# Altium schematic sheet Main.SchDoc
size A4; SheetNumber: 1; SheetTotal: 7
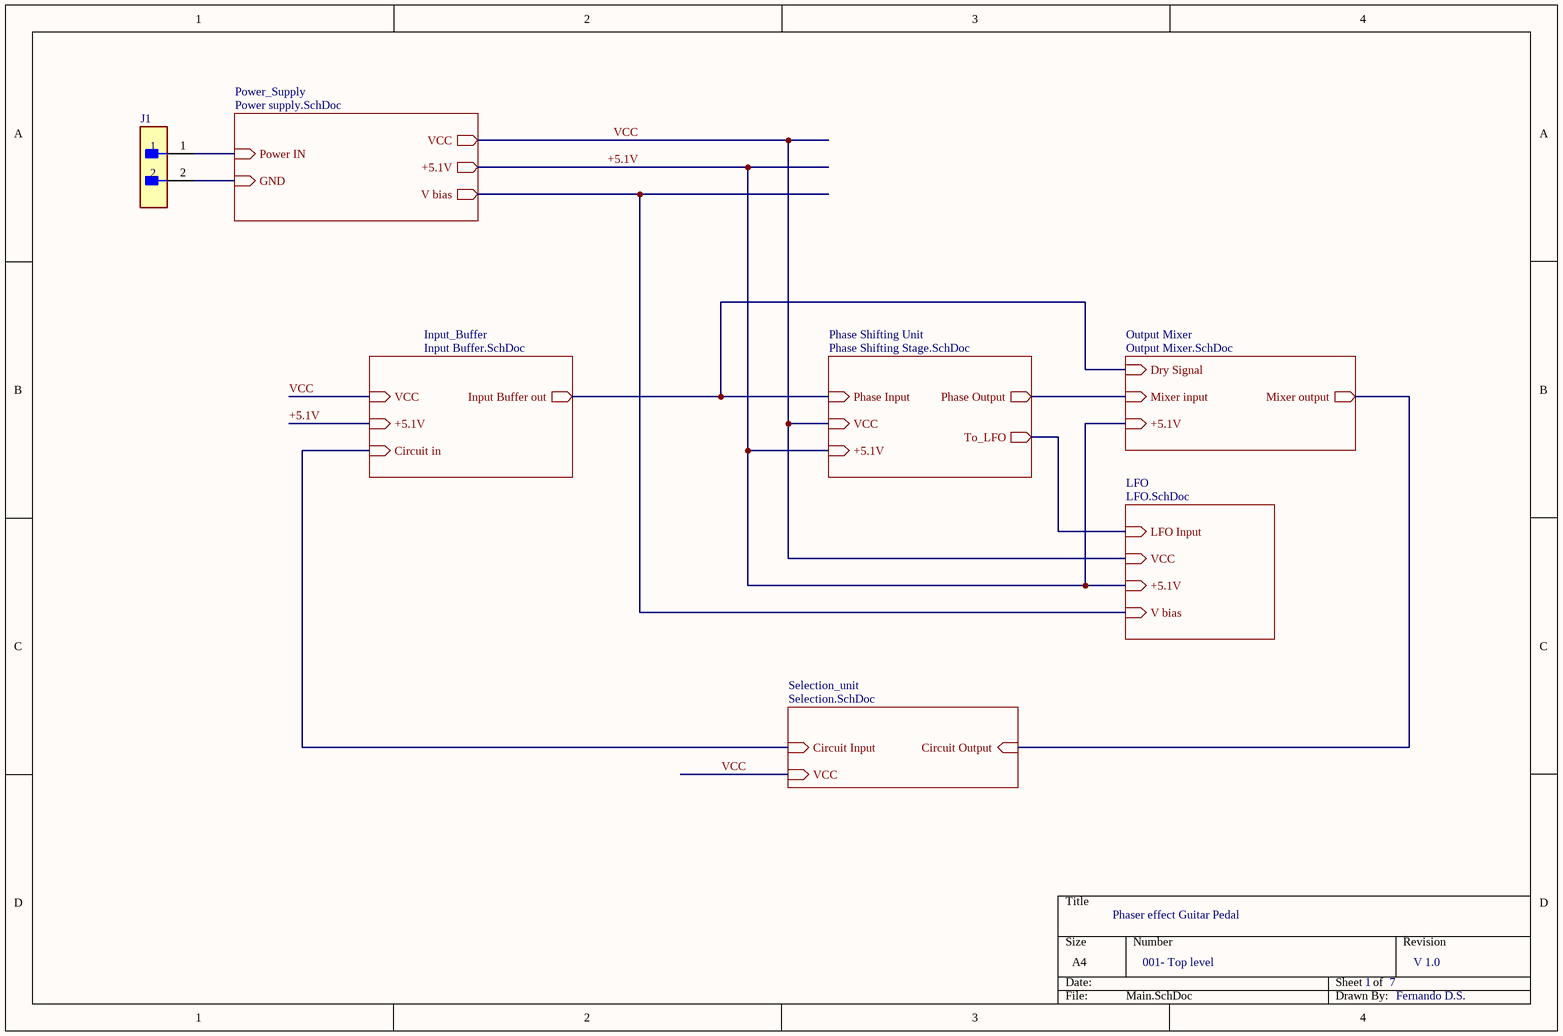
[diagram p0: Main.SchDoc]

## Parts
J1  B2B-EH-A(LF)(SN)  [FP-B2B-EH-A_LF_SN-MFG]  (value not drawn)

## Sub-sheets
Input_Buffer = Input Buffer.SchDoc: Circuit in (in), Input Buffer out (out), +5.1V (in), VCC (in)
LFO = LFO.SchDoc: LFO Input (in), VCC (in), +5.1V (in), V bias (in)
Output Mixer = Output Mixer.SchDoc: Dry Signal (in), Mixer input (in), Mixer output (out), +5.1V (in)
Phase Shifting Unit = Phase Shifting Stage.SchDoc: Phase Input (in), Phase Output (out), To_LFO (out), VCC (in), +5.1V (in)
Power_Supply = Power supply.SchDoc: Power IN (in), GND (in), VCC (out), +5.1V (out), V bias (out)
Selection_unit = Selection.SchDoc: Circuit Input (in), Circuit Output (in), VCC (in)

## Nets
+5.1V: sheet Input_Buffer/+5.1V, sheet Phase Shifting Unit/+5.1V, sheet LFO/+5.1V, sheet Output Mixer/+5.1V, sheet Power_Supply/+5.1V
VCC: sheet Input_Buffer/VCC, sheet Phase Shifting Unit/VCC, sheet LFO/VCC, sheet Selection_unit/VCC, sheet Power_Supply/VCC
NetJ1_1: J1.1 ; sheet Power_Supply/Power IN
NetJ1_2: J1.2 ; sheet Power_Supply/GND
(unnamed): sheet Input_Buffer/Circuit in, sheet Selection_unit/Circuit Input
(unnamed): sheet Input_Buffer/Input Buffer out, sheet Phase Shifting Unit/Phase Input, sheet Output Mixer/Dry Signal
(unnamed): sheet Phase Shifting Unit/Phase Output, sheet Output Mixer/Mixer input
(unnamed): sheet Phase Shifting Unit/To_LFO, sheet LFO/LFO Input
(unnamed): sheet LFO/V bias, sheet Power_Supply/V bias
(unnamed): sheet Output Mixer/Mixer output, sheet Selection_unit/Circuit Output

## Notes on the sheet
- Phaser effect Guitar Pedal
- 001- Top level
- 1
- 7
- V 1.0
- Fernando D.S.

## Library data of the parts
J1 = CMP-17439-000026-1: CONN HEADER VERT 2POS 2.5MM; Number of Contacts: 2; Current Rating: 3A; Connector Type: Plug; Contact Resistance: 20mR; Gender: Male; Voltage Rating: 250V; Fastening Type: Detent; Depth: 3.8mm; Max Operating Temperature: 85°C; Orientation: Straight; Series: EH; Contact Plating: Tin; Min Operating Temperature: -25°C; Contact Type: Male Pin; Housing Color: White; Termination: Press-Fit; Housing Material: Nylon; Pitch: 2.5mm; Number of Positions: 2; Max Current Rating: 3A; Packaging: Bulk; Lead Free: Lead Free; Number of Rows: 1; Length: 7.5mm; Contact Mating Length: 0.13inch; Color: Natural; Max Voltage Rating (AC): 250V; Contact Material: Copper Alloy; Mount: Through Hole